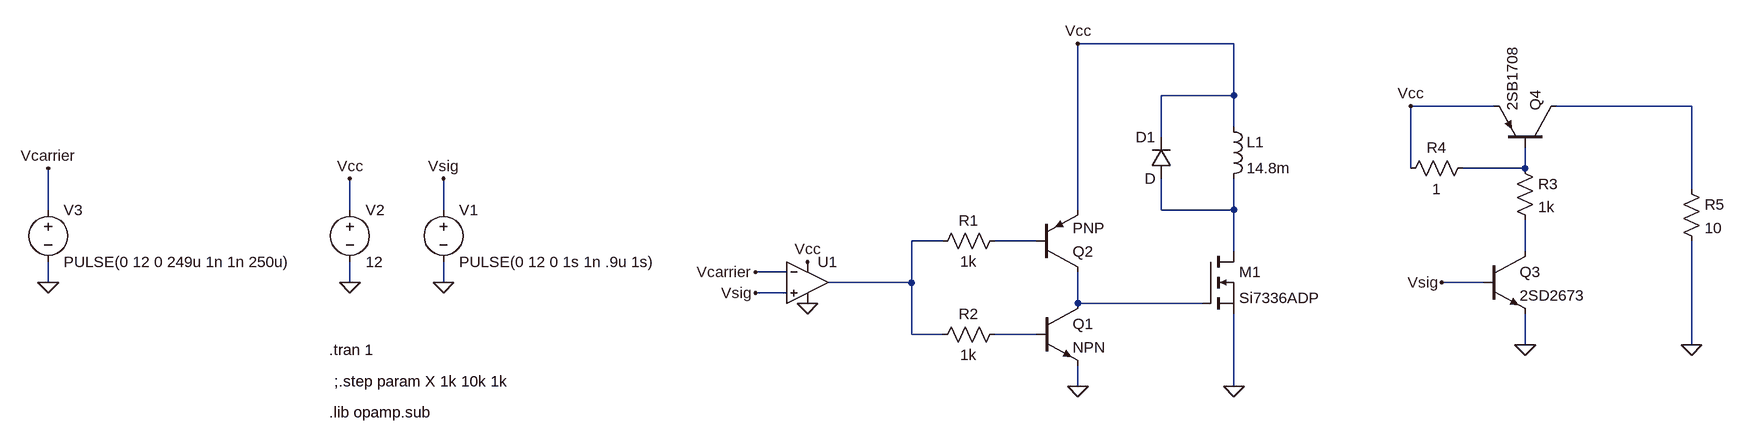
[diagram p0: schematic CoilDriver.asc]
CoilDriver.asc, the LTspice schematic file:
Version 4
SHEET 1 1096 680
WIRE 336 -32 96 -32
WIRE 336 48 336 -32
WIRE 336 48 224 48
WIRE 736 64 608 64
WIRE 1040 64 832 64
WIRE 336 96 336 48
WIRE 224 112 224 48
WIRE 608 160 608 64
WIRE 784 160 784 128
WIRE 784 160 688 160
WIRE 1040 192 1040 64
WIRE -1488 224 -1488 160
WIRE -1024 224 -1024 176
WIRE -880 224 -880 176
WIRE 96 224 96 -32
WIRE 224 224 224 176
WIRE 336 224 336 176
WIRE 336 224 224 224
WIRE -112 272 -160 272
WIRE 32 272 -32 272
WIRE 336 288 336 224
WIRE 784 288 784 240
WIRE -352 320 -400 320
WIRE -1488 336 -1488 304
WIRE -1024 336 -1024 304
WIRE -880 336 -880 304
WIRE -160 336 -160 272
WIRE -160 336 -288 336
WIRE 720 336 656 336
WIRE -352 352 -400 352
WIRE 96 368 96 320
WIRE 288 368 96 368
WIRE -160 416 -160 336
WIRE -112 416 -160 416
WIRE 32 416 -32 416
WIRE 784 432 784 384
WIRE 1040 432 1040 272
WIRE 96 496 96 464
WIRE 336 496 336 384
FLAG 336 496 0
FLAG -1024 336 0
FLAG -880 336 0
FLAG 96 496 0
FLAG -1024 176 Vcc
FLAG 96 -32 Vcc
FLAG -880 176 Vsig
FLAG -400 352 Vsig
FLAG 784 432 0
FLAG 1040 432 0
FLAG 656 336 Vsig
FLAG 608 64 Vcc
FLAG -1488 160 Vcarrier
FLAG -1488 336 0
FLAG -400 320 Vcarrier
FLAG -320 368 0
FLAG -320 304 Vcc
SYMBOL nmos 288 288 R0
SYMATTR InstName M1
SYMATTR Value Si7336ADP
SYMBOL diode 240 176 R180
WINDOW 0 24 64 Left 2
WINDOW 3 24 0 Left 2
SYMATTR InstName D1
SYMBOL voltage -880 208 R0
WINDOW 123 0 0 Left 0
WINDOW 39 0 0 Left 0
SYMATTR InstName V1
SYMATTR Value PULSE(0 12 0 1s 1n .9u 1s)
SYMBOL voltage -1024 208 R0
WINDOW 123 0 0 Left 0
WINDOW 39 0 0 Left 0
SYMATTR InstName V2
SYMATTR Value 12
SYMBOL ind 320 80 R0
SYMATTR InstName L1
SYMATTR Value 14.8m
SYMATTR SpiceLine Rser=12
SYMBOL npn 32 368 R0
SYMATTR InstName Q1
SYMBOL pnp 32 320 M180
SYMATTR InstName Q2
SYMBOL res -16 256 R90
WINDOW 0 0 56 VBottom 2
WINDOW 3 32 56 VTop 2
SYMATTR InstName R1
SYMATTR Value 1k
SYMBOL res -16 400 R90
WINDOW 0 0 56 VBottom 2
WINDOW 3 32 56 VTop 2
SYMATTR InstName R2
SYMATTR Value 1k
SYMBOL npn 720 288 R0
SYMATTR InstName Q3
SYMATTR Value 2SD2673
SYMBOL pnp 832 128 M270
SYMATTR InstName Q4
SYMATTR Value 2SB1708
SYMBOL res 768 144 R0
SYMATTR InstName R3
SYMATTR Value 1k
SYMBOL res 704 144 R90
WINDOW 0 0 56 VBottom 2
WINDOW 3 32 56 VTop 2
SYMATTR InstName R4
SYMATTR Value 1
SYMBOL res 1024 176 R0
SYMATTR InstName R5
SYMATTR Value 10
SYMBOL voltage -1488 208 R0
WINDOW 123 0 0 Left 0
WINDOW 39 0 0 Left 0
SYMATTR InstName V3
SYMATTR Value PULSE(0 12 0 249u 1n 1n 250u)
SYMBOL OpAmps\\UniversalOpAmp2 -320 336 R0
SYMATTR InstName U1
TEXT -1056 440 Left 2 !.tran 1
TEXT -1048 488 Left 2 !;.step param X 1k 10k 1k
TEXT -1056 536 Left 2 !.lib opamp.sub

The netlist it stands for:
* CoilDriver.asc
M1 N003 N007 0 0 Si7336ADP
D1 N003 Vcc D
V1 Vsig 0 PULSE(0 12 0 1s 1n .9u 1s)
V2 Vcc 0 12
L1 Vcc N003 14.8m Rser=12
Q1 N007 N008 0 0 NPN
Q2 N007 N005 Vcc 0 PNP
R1 N005 N004 1k
R2 N008 N004 1k
Q3 N006 Vsig 0 0 2SD2673
Q4 N001 N002 Vcc 0 2SB1708
R3 N002 N006 1k
R4 N002 Vcc 1
R5 N001 0 10
V3 Vcarrier 0 PULSE(0 12 0 249u 1n 1n 250u)
XU1 Vsig Vcarrier Vcc 0 N004 level2 Avol=1Meg GBW=10Meg Slew=10Meg Ilimit=25m Rail=0 Vos=0 En=0 Enk=0 In=0 Ink=0 Rin=500Meg  ; pins In+ In- V+ V- OUT
.model D D
.lib standard.dio
.model NPN NPN
.model PNP PNP
.lib standard.bjt
.model NMOS NMOS
.model PMOS PMOS
.lib standard.mos
.tran 1
;.step param X 1k 10k 1k
.lib opamp.sub
.lib UniversalOpAmp2.lib
.backanno
.end